# EAGLE design Fuzz (EAGLE 6.4)
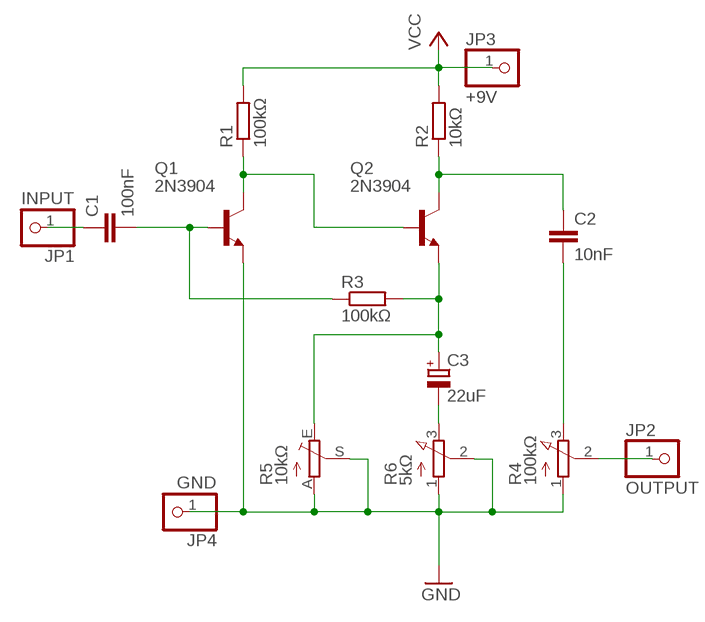
[diagram p0: schematic, sheet 1]

## Parts
C1  100nF  C-EU050-024X044  [C050-024X044]
C2  10nF  C-EU050-024X044  [C050-024X044]
C3  22uF  CPOL-EUE5-5  [E5-5]
JP1  INPUT  PINHD-1X1  [1X01]
JP2  OUTPUT  PINHD-1X1  [1X01]
JP3  +9V  PINHD-1X1  [1X01]
JP4  GND  PINHD-1X1  [1X01]
Q1  2N3904  -NPN-TO92-EBC  [TO92-EBC]
Q2  2N3904  -NPN-TO92-EBC  [TO92-EBC]
R1  100kΩ  R-EU_0207/10  [0207/10]
R2  10kΩ  R-EU_0207/10  [0207/10]
R3  100kΩ  R-EU_0207/10  [0207/10]
R4  100kΩ  3RP/1610N  [3RP/1610N]
R5  10kΩ  TRIM_EU-CA6V  [CA6V]
R6  5kΩ  3RP/1610N  [3RP/1610N]

## Nets
GND: JP4.1 Q1.E R4.1(A) R5.A R5.S R6.1(A) R6.2(S)
INPUT: C1.1 JP1.1
N$1: C1.2 Q1.B R3.1
N$2: Q1.C Q2.B R1.1
N$3: C2.1 Q2.C R2.1
N$4: C2.2 R4.3(E)
N$5: C3.+ Q2.E R3.2 R5.E
N$6: C3.- R6.3(E)
OUTPUT: JP2.1 R4.2(S)
VCC: JP3.1 R1.2 R2.2

## Library data of the parts
C1 C2 = rcl:C-EU: CAPACITOR, European symbol
C3 = rcl:CPOL-EU: POLARIZED CAPACITOR, European symbol
JP1-JP4 = pinhead:PINHD-1X1: PIN HEADER
Q1 Q2 = transistor:*-NPN-: NPN Transistror BF959 corrected 2008.03.06
R1-R3 = rcl:R-EU_: RESISTOR, European symbol
R4 R6 = pot:3RP/1610N: 16mm Potentiometer one level Source: http://www.alphapotentiometers.net/html/16mm_pot_2.html
R5 = pot:TRIM_EU-: POTENTIOMETER

## Board
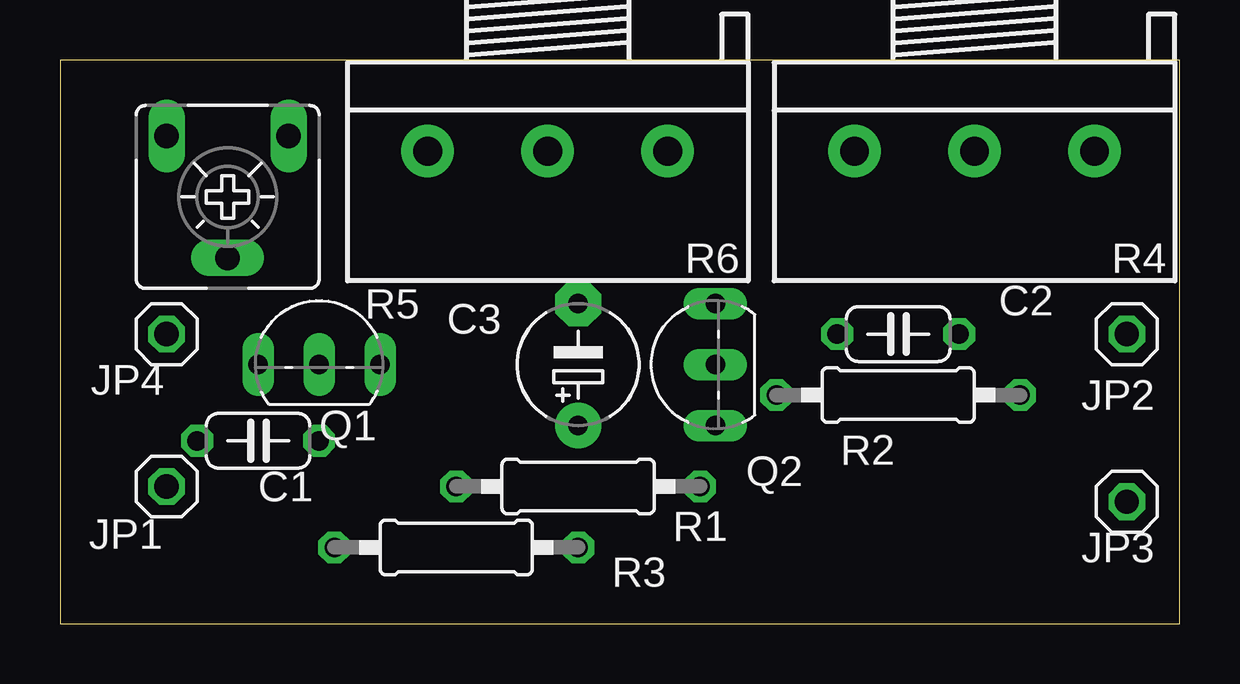
[diagram p1: board, top side]
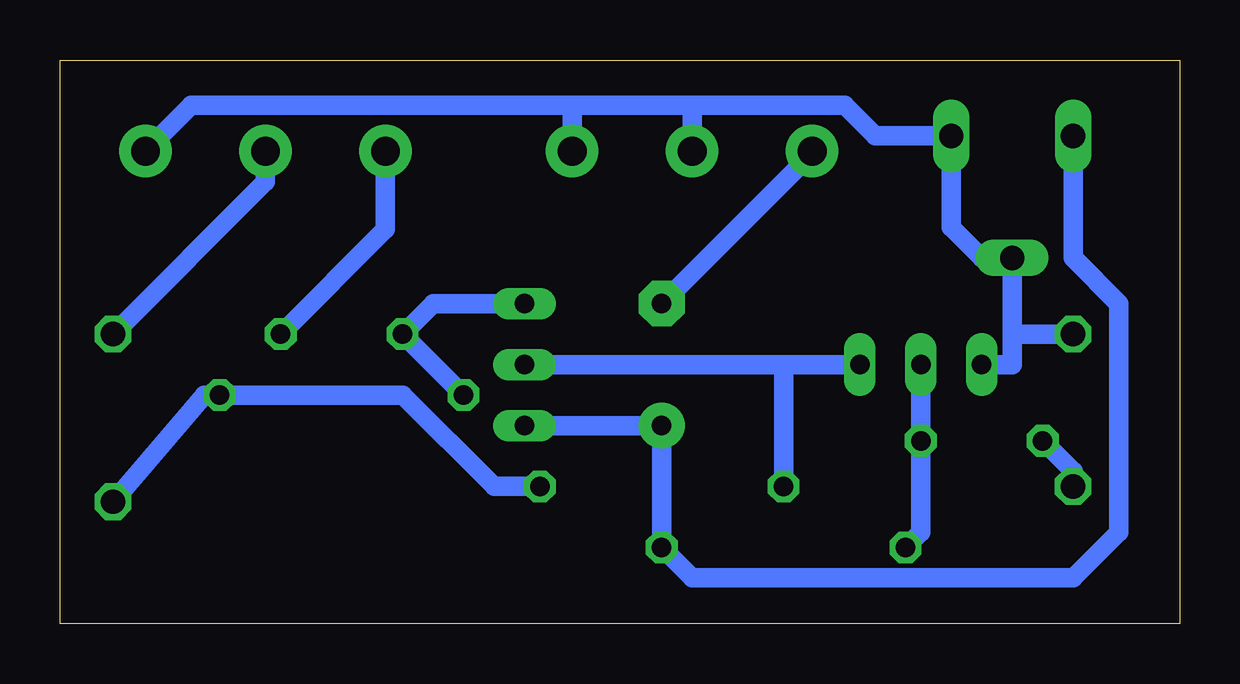
[diagram p2: board, bottom side, seen from below]

Size 46.66 x 23.48 mm. Coordinates in mm from the lower left corner, seen from the top.
Outline: 0,0 46.66,0 46.66,23.48 0,23.48 0,0
Copper layers (1*16): Top 0.035mm / dielectric 1.5mm / Bottom 0.035mm
Design rules "default": minimum track width 10mil, minimum drill 24mil, track to track 8mil, track to pad 8mil, pad to pad 8mil, via to via 8mil, smd to smd 8mil, copper to edge 40mil, drill to drill 8mil, minimum pad ring 10mil, minimum via ring 8mil, stop-mask expansion 4mil, vias tented up to drill 0mil, thermal gap 10mil

### Footprints (pad centres in the part's own frame; a part is rotated, then mirrored left to right if it is on the bottom)
C050-024X044 = drill 0.813 octagon: 1 -2.54,0; 2 2.54,0
E5-5 = drill 0.813 pad 1.905: + -2.54,0 | drill 0.813 pad 1.905 octagon: - 2.54,0
1X01 = drill 1.016 octagon: 1 0,0
TO92-EBC = drill 0.813 long: B 0,-1.27; C 2.54,-1.27; E -2.54,-1.27
0207/10 = drill 0.813 octagon: 1 -5.08,0; 2 5.08,0
3RP/1610N = drill 1.2 pad 2.184: 1 -5,0; 2 0,0; 3 5,0
CA6V = drill 1.016 long: A -2.54,-2.54; E 2.54,-2.54; S 0,2.54

### Placement (x,y rotation side)
C1  8.26,7.62 0 top
C2  34.92,12.06 0 top
C3  21.59,10.8 90 top
JP1  4.45,5.71 0 top
JP2  44.45,12.06 270 top
JP3  44.45,5.08 270 top
JP4  4.45,12.06 0 top
Q1  10.79,12.06 0 top
Q2  26.03,10.8 90 top
R1  21.59,5.71 0 top
R2  34.92,9.53 0 top
R3  16.51,3.17 0 top
R4  38.1,19.69 180 top
R5  6.99,17.78 180 top
R6  20.32,19.69 180 top

### Tracks (layer width: path | path; a pad name or v marks a point on that pad's centre or on a via)
GND
  Bottom 0.813: 20.32,21.59 25.4,21.59 | R6.1 25.32,21.51 25.4,21.59 | R6.2 20.32,21.59 | 20.32,21.59 13.97,21.59 12.7,20.32 R5.A 9.53,16.51 8.26,15.24 R5.S 6.99,12.06 | 6.99,12.06 6.99,10.8 Q1.E | JP4.1 6.99,12.06 | R4.1 41.2,21.59 25.4,21.59
INPUT
  Bottom 0.813: JP1.1 4.45,6.35 C1.1
N$1
  Bottom 0.813: Q1.B C1.2 10.79,3.81 R3.1
N$2
  Bottom 0.813: Q1.C 16.51,10.8 | 16.51,10.8 Q2.B | R1.1 16.51,10.8
N$3
  Bottom 0.813: Q2.C 31.12,13.33 C2.1 R2.1
N$4
  Bottom 0.813: R4.3 33.1,16.43 C2.2
N$5
  Bottom 0.813: Q2.E C3.+ R3.2 20.32,1.91 4.45,1.91 2.54,3.81 2.54,13.33 4.45,15.24 R5.E
N$6
  Bottom 0.813: R6.3 15.32,19.61 C3.-
OUTPUT
  Bottom 0.813: R4.2 38.1,18.42 JP2.1
VCC
  Bottom 0.813: JP3.1 40.64,9.53 R2.2 32.38,9.53 28.57,5.71 R1.2